# Altium schematic sheet battery.SchDoc
size A4; SheetNumber: 1; SheetTotal: 1
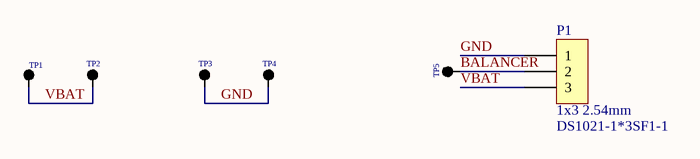
[diagram p0: battery.SchDoc]

## Parts
P1  value DS1021-1*3SF1-1  SCH_Footprint: 1x3 2.54mm  [P_HEADER_1x3_2.54]  (hidden comment: Goldpin)
TP1  SMD pad  [TP_PAD]  (value not drawn)
TP2  SMD pad  [TP_PAD]  (value not drawn)
TP3  SMD pad  [TP_PAD]  (value not drawn)
TP4  SMD pad  [TP_PAD]  (value not drawn)
TP5  Single pin  [TP_1PIN]  (value not drawn)

## Nets
BALANCER: P1.2 TP5.1(TP)
GND: P1.1 TP3.1(TP) TP4.1(TP)
VBAT: P1.3 TP1.1(TP) TP2.1(TP)

## Library data of the parts
P1 = P_HEADER_1x3_2.54: Pin Header; Manufacturer: Connfly; Part Number: P_HEADER_1x3_2.54; HelpURL: http://www.tme.eu/en/Document/cc301e58a5da78cb543a94b5a5b7f06a/DS1021.pdf; Manufacturer Part Number: DS1021-1*3SF1-1; Supplier 1: TME; Supplier Part Number 1: ZL201-03G; Supplier 2: RS Components; Supplier 3: Farnell; Supplier 4: Mouser; Supplier 5: Digi-Key; Supplier 6: LCSC
TP1-TP4 = TP_PAD: Testpoint; SCH_Footprint: SMD; Part Number: TP_PAD; Supplier 1: TME; Supplier 2: RS Components; Supplier 3: Farnell; Supplier 4: Mouser; Supplier 5: Digi-Key; Supplier 6: LCSC
TP5 = TP_1PIN: Testpoint; SCH_Footprint: Single; Part Number: TP_1PIN; Supplier 1: TME; Supplier 2: RS Components; Supplier 3: Farnell; Supplier 4: Mouser; Supplier 5: Digi-Key; Supplier 6: LCSC